# EAGLE design quantizer_v10 (EAGLE 9.6.2)

## Sheet 1 of 2
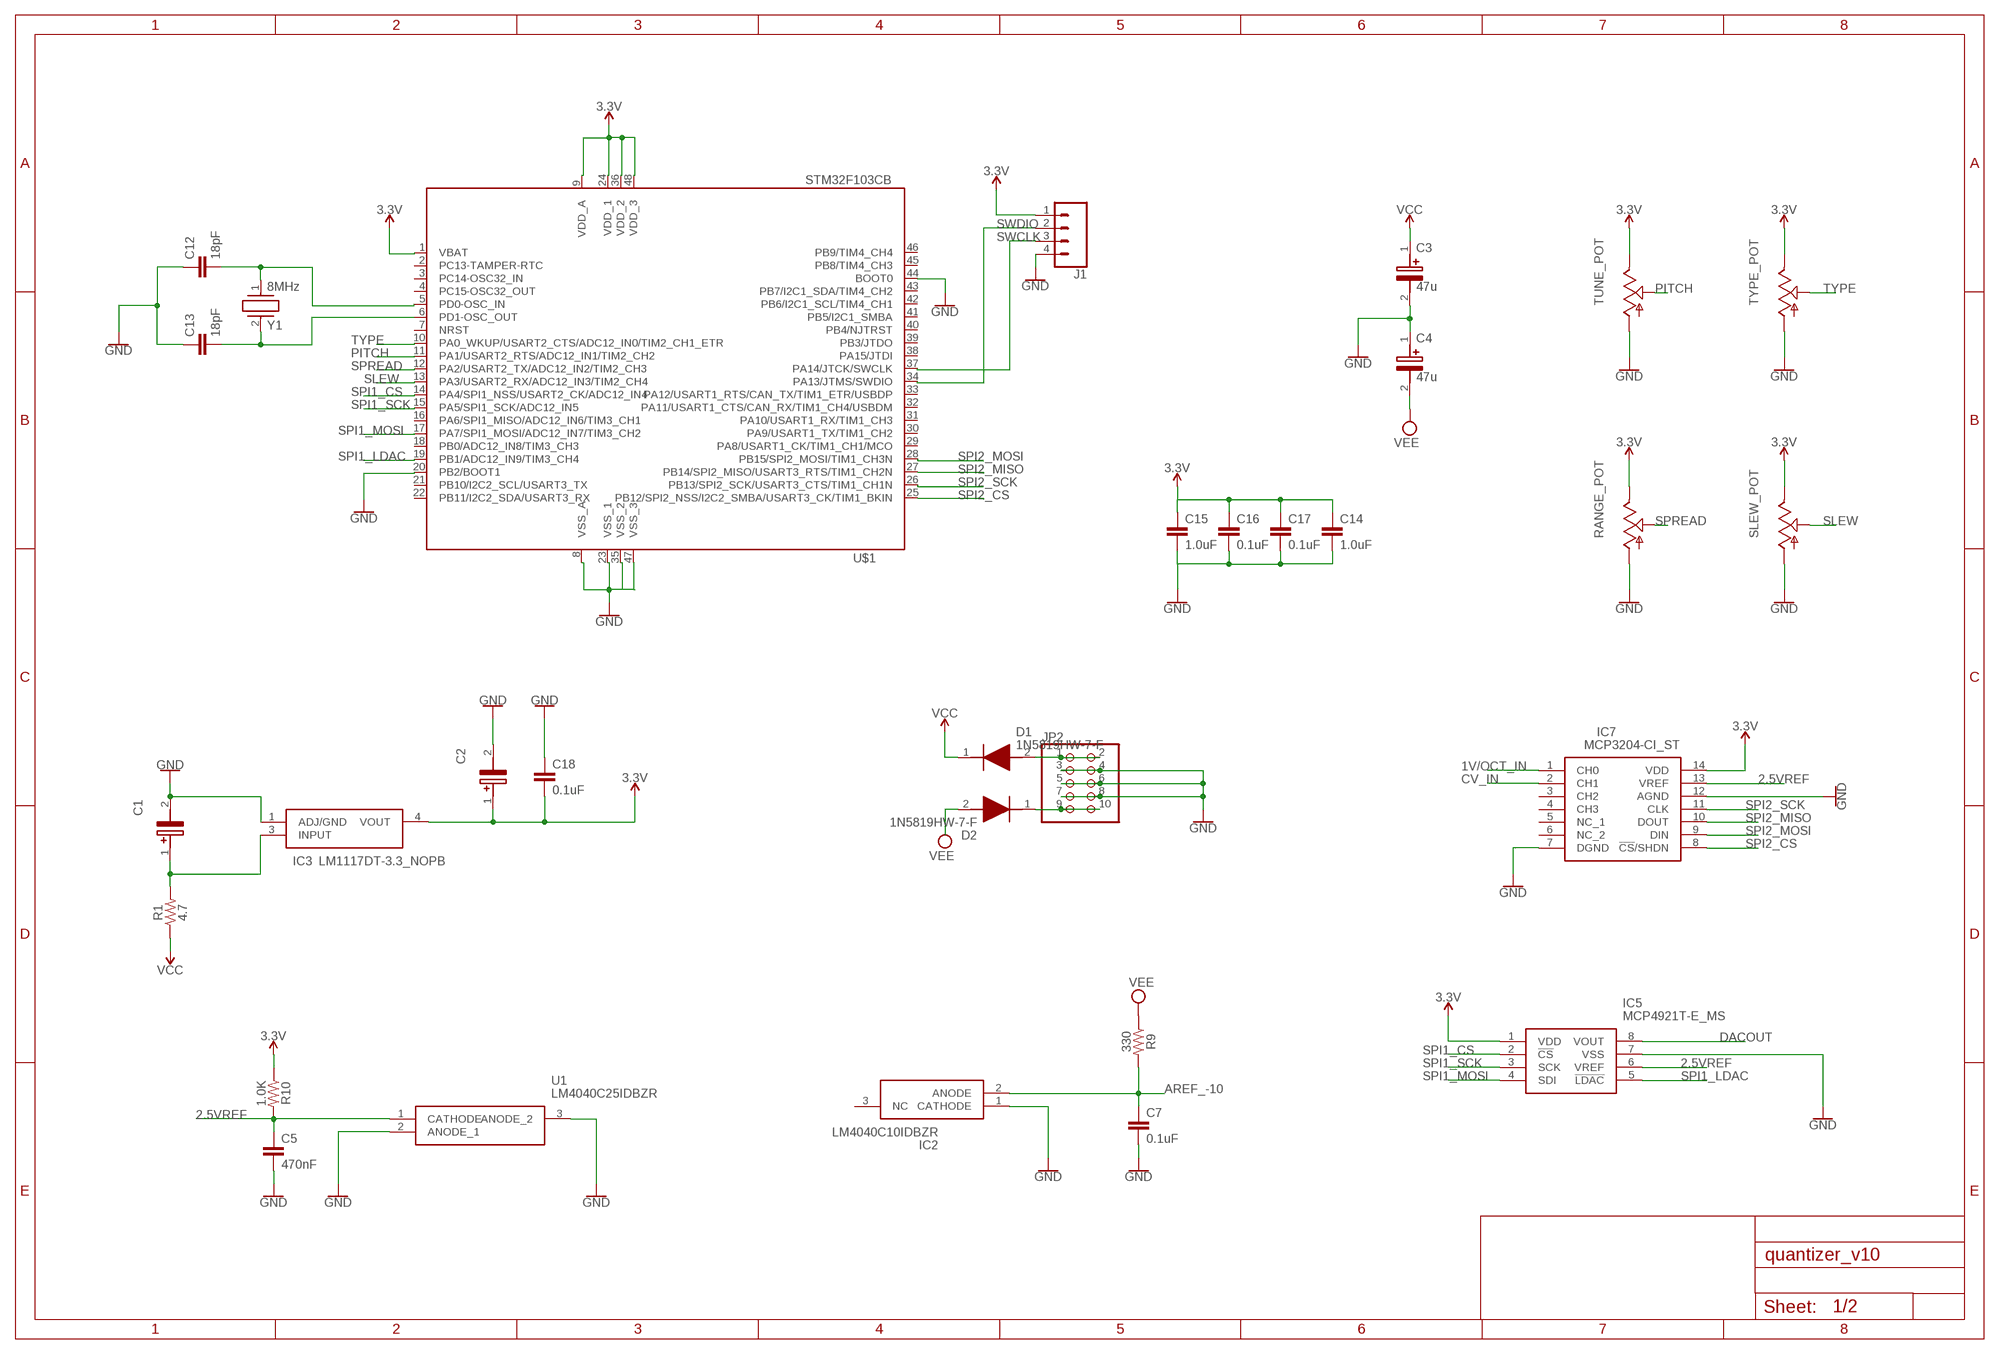
[diagram p0: schematic, sheet 1]

### Parts
C1  22uF  EEE-FP1E220AR  [EEE0GA101SR]
C2  22uF  EEE-FP1E220AR  [EEE0GA101SR]
C3  47u  EEE-FK1V470P  [EEE1AA101SP]
C4  47u  EEE-FK1V470P  [EEE1AA101SP]
C5  470nF  0.1UF-0603-25V-(+80/-20%)  [0603]
C7  0.1uF  0.1UF-0603-25V-(+80/-20%)  [0603]
C12  18pF  18PF-0603-50V-5%  [0603]
C13  18pF  18PF-0603-50V-5%  [0603]
C14  1.0uF  1.0UF-0603-16V-10%  [0603]
C15  1.0uF  1.0UF-0603-16V-10%  [0603]
C16  0.1uF  0.1UF-0603-25V-(+80/-20%)  [0603]
C17  0.1uF  0.1UF-0603-25V-(+80/-20%)  [0603]
C18  0.1uF  0.1UF-0603-25V-(+80/-20%)  [0603]
D1  1N5819HW-7-F  [SOD3716X145N]
D2  1N5819HW-7-F  [SOD3716X145N]
IC2  LM4040C10IDBZR  [SOT95P237X112-3N]
IC3  LM1117DT-3.3_NOPB  [TO228P991X238-3N]
IC5  MCP4921T-E_MS  [SOP65P490X110-8N]
IC7  MCP3204-CI_ST  [SOP65P640X120-14N]
J1  CONN_04  [1X04]
JP2  PINHD-2X5  [2X05]
R1  4.7  RESISTOR1206  [1206]
R9  330  RESISTOR0603  [0603]
R10  1.0K  RESISTOR0603  [0603]
RANGE_POT  POT_USVERTICAL_PS  [ALPS_POT_VERTICAL_PS]
SLEW_POT  POTENTIOMETER-ALPHA-9MM_VERTICAL_  [POTENTIOMETER-ALPHA-9MM_VERTICAL]
TUNE_POT  POT_USVERTICAL_PS  [ALPS_POT_VERTICAL_PS]
TYPE_POT  POT_USVERTICAL_PS  [ALPS_POT_VERTICAL_PS]
U1  LM4040C25IDBZR  [SOT95P237X112-3N]
U$1  STM32F103CB  [LQFP48]
Y1  8MHz  ABLS3-8.000MHZ-D4Y-T  [ABLS]

### Nets
1V/OCT_IN: IC7.1(CH0) ; also sheet 2
2.5VREF: C5.1 IC5.6(VREF) IC7.13(VREF) R10.2 U1.1(CATHODE)
3.3V: C2.1(+) C18.2 IC3.4(VOUT) IC5.1(VDD) IC7.14(VDD) J1.1 R10.1 RANGE_POT.P$1(E) SLEW_POT.3(E) TUNE_POT.P$1(E) TYPE_POT.P$1(E) U$1.1(VBAT) U$1.9(VDD_A) U$1.24(VDD_1) U$1.36(VDD_2) U$1.48(VDD_3)
AREF_-10: C7.1 IC2.2(ANODE) R9.2 ; also sheet 2
CV_IN: IC7.2(CH1) ; also sheet 2
DACOUT: IC5.8(VOUT) ; also sheet 2
GND: C1.2(-) C2.2(-) C3.2(-) C4.1(+) C5.2 C7.2 C12.1 C13.1 C18.1 IC2.1(CATHODE) IC3.1(ADJ/GND) IC5.7(VSS) IC7.7(DGND) IC7.12(AGND) J1.4 JP2.3 JP2.4 JP2.5 JP2.6 JP2.7 JP2.8 RANGE_POT.P$3(A) SLEW_POT.1(A) TUNE_POT.P$3(A) TYPE_POT.P$3(A) U1.2(ANODE_1) U1.3(ANODE_2) U$1.8(VSS_A) U$1.20(PB2/BOOT1) U$1.23(VSS_1) U$1.35(VSS_2) U$1.44(BOOT0) U$1.47(VSS_3) ; also sheet 2
N$2: C1.1(+) IC3.3(INPUT) R1.2
N$4: D1.2(A) JP2.1 JP2.2
N$6: D2.1(K) JP2.9 JP2.10
N$10: C12.2 U$1.5(PD0-OSC_IN) Y1.1
N$11: C13.2 U$1.6(PD1-OSC_OUT) Y1.2
N$12: C14.1 C15.1 C16.1 C17.1 ; supply symbol labelled 3.3V
N$14: C14.2 C15.2 C16.2 C17.2 ; supply symbol labelled GND
PITCH: TUNE_POT.P$2(S) U$1.11(PA1/USART2_RTS/ADC12_IN1/TIM2_CH2)
SLEW: SLEW_POT.2(S) U$1.13(PA3/USART2_RX/ADC12_IN3/TIM2_CH4)
SPI1_CS: IC5.2(!CS) U$1.14(PA4/SPI1_NSS/USART2_CK/ADC12_IN4)
SPI1_LDAC: IC5.5(!LDAC) U$1.19(PB1/ADC12_IN9/TIM3_CH4)
SPI1_MOSI: IC5.4(SDI) U$1.17(PA7/SPI1_MOSI/ADC12_IN7/TIM3_CH2)
SPI1_SCK: IC5.3(SCK) U$1.15(PA5/SPI1_SCK/ADC12_IN5)
SPI2_CS: IC7.8(!CS!/SHDN) U$1.25(PB12/SPI2_NSS/I2C2_SMBA/USART3_CK/TIM1_BKIN)
SPI2_MISO: IC7.10(DOUT) U$1.27(PB14/SPI2_MISO/USART3_RTS/TIM1_CH2N)
SPI2_MOSI: IC7.9(DIN) U$1.28(PB15/SPI2_MOSI/TIM1_CH3N)
SPI2_SCK: IC7.11(CLK) U$1.26(PB13/SPI2_SCK/USART3_CTS/TIM1_CH1N)
SPREAD: RANGE_POT.P$2(S) U$1.12(PA2/USART2_TX/ADC12_IN2/TIM2_CH3)
SWCLK: J1.3 U$1.37(PA14/JTCK/SWCLK)
SWDIO: J1.2 U$1.34(PA13/JTMS/SWDIO)
TYPE: TYPE_POT.P$2(S) U$1.10(PA0_WKUP/USART2_CTS/ADC12_IN0/TIM2_CH1_ETR)
VCC: C3.1(+) D1.1(K) R1.1 ; also sheet 2
VEE: C4.2(-) D2.2(A) R9.1 ; also sheet 2
Unconnected: IC2.3(NC) IC7.3(CH2) IC7.4(CH3) IC7.5(NC_1) IC7.6(NC_2) U$1.2(PC13-TAMPER-RTC) U$1.3(PC14-OSC32_IN) U$1.4(PC15-OSC32_OUT) U$1.7(NRST) U$1.16(PA6/SPI1_MISO/ADC12_IN6/TIM3_CH1) U$1.18(PB0/ADC12_IN8/TIM3_CH3) U$1.21(PB10/I2C2_SCL/USART3_TX) U$1.22(PB11/I2C2_SDA/USART3_RX) U$1.29(PA8/USART1_CK/TIM1_CH1/MCO) U$1.30(PA9/USART1_TX/TIM1_CH2) U$1.31(PA10/USART1_RX/TIM1_CH3) U$1.32(PA11/USART1_CTS/CAN_RX/TIM1_CH4/USBDM) U$1.33(PA12/USART1_RTS/CAN_TX/TIM1_ETR/USBDP) U$1.38(PA15/JTDI) U$1.39(PB3/JTDO) U$1.40(PB4/NJTRST) U$1.41(PB5/I2C1_SMBA) U$1.42(PB6/I2C1_SCL/TIM4_CH1) U$1.43(PB7/I2C1_SDA/TIM4_CH2) U$1.45(PB8/TIM4_CH3) U$1.46(PB9/TIM4_CH4)

## Sheet 2 of 2
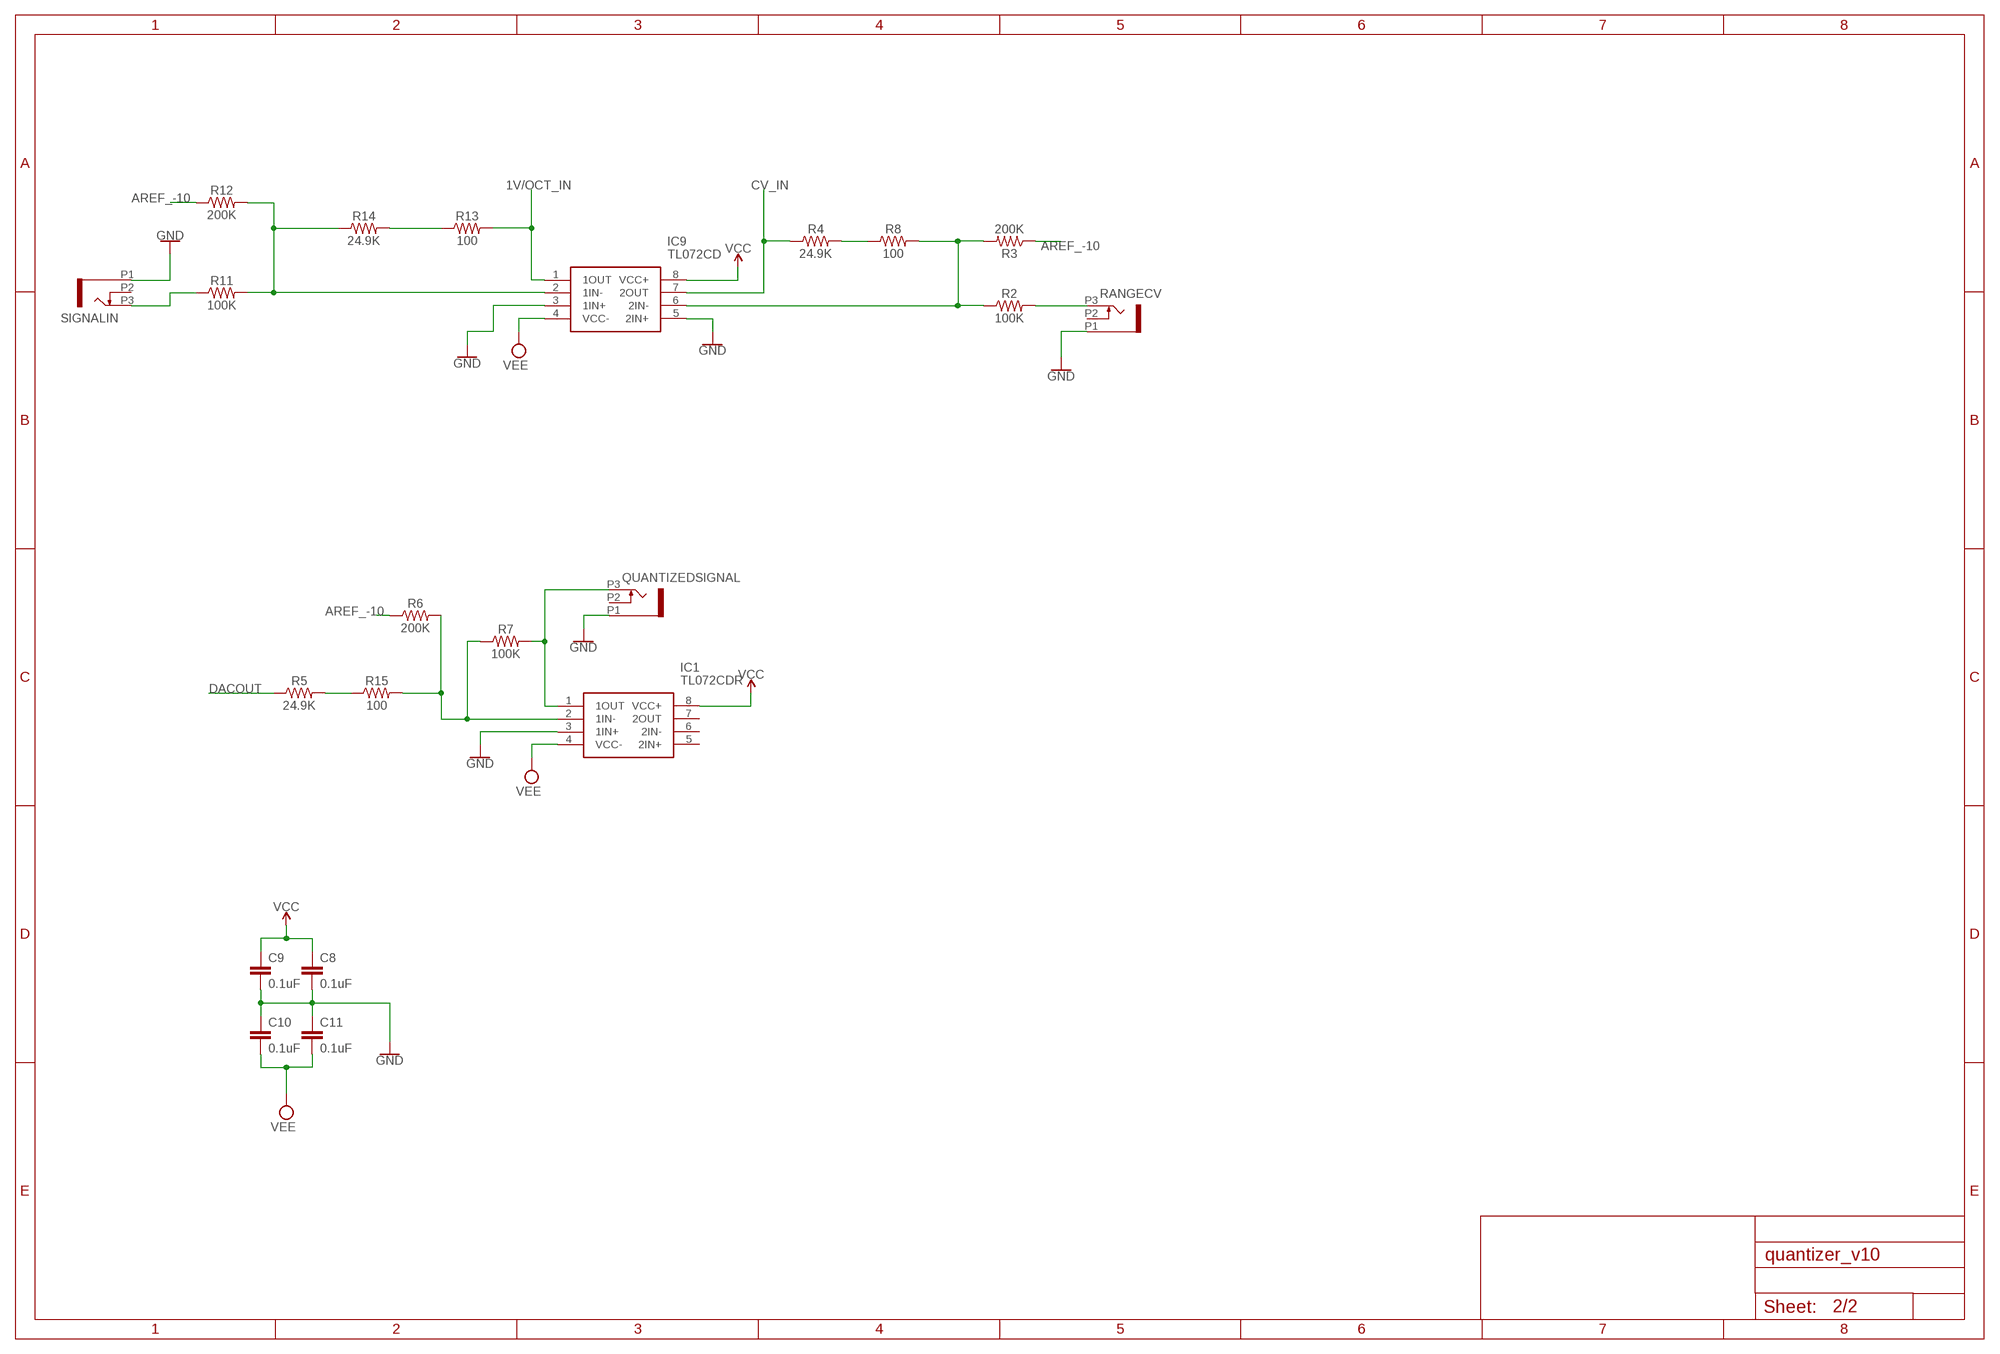
[diagram p1: schematic, sheet 2]

### Parts
C8  0.1uF  0.1UF-0603-25V-(+80/-20%)  [0603]
C9  0.1uF  0.1UF-0603-25V-(+80/-20%)  [0603]
C10  0.1uF  0.1UF-0603-25V-(+80/-20%)  [0603]
C11  0.1uF  0.1UF-0603-25V-(+80/-20%)  [0603]
IC1  TL072CDR  [SOIC127P600X175-8N]
IC9  TL072CD  [SOIC127P600X175-8N]
QUANTIZEDSIGNAL  PJ301_THONKICONN6  [WQP_PJ_301M6]
R2  100K  RESISTOR0603  [0603]
R3  200K  RESISTOR0603  [0603]
R4  24.9K  RESISTOR0603  [0603]
R5  24.9K  RESISTOR0603  [0603]
R6  200K  RESISTOR0603  [0603]
R7  100K  RESISTOR0603  [0603]
R8  100  RESISTOR0603  [0603]
R11  100K  RESISTOR0603  [0603]
R12  200K  RESISTOR0603  [0603]
R13  100  RESISTOR0603  [0603]
R14  24.9K  RESISTOR0603  [0603]
R15  100  RESISTOR0603  [0603]
RANGECV  PJ301_THONKICONN6  [WQP_PJ_301M6]
SIGNALIN  PJ301_THONKICONN6  [WQP_PJ_301M6]

### Nets
1V/OCT_IN: IC9.1(1OUT) R13.2 ; also sheet 1
AREF_-10: R3.1 R6.1 R12.1 ; also sheet 1
CV_IN: IC9.7(2OUT) R4.1 ; also sheet 1
DACOUT: R5.1 ; also sheet 1
GND: C8.2 C9.2 C10.1 C11.1 IC1.3(1IN+) IC9.3(1IN+) IC9.5(2IN+) QUANTIZEDSIGNAL.P1 RANGECV.P1 SIGNALIN.P1 ; also sheet 1
N$3: R4.2 R8.1
N$5: R11.1 SIGNALIN.P3
N$7: IC9.6(2IN-) R2.1 R3.2 R8.2
N$8: IC9.2(1IN-) R11.2 R12.2 R14.1
N$9: R2.2 RANGECV.P3
N$13: IC1.1(1OUT) QUANTIZEDSIGNAL.P3 R7.2
N$15: R13.1 R14.2
N$16: R5.2 R15.1
N$17: IC1.2(1IN-) R6.2 R7.1 R15.2
VCC: C8.1 C9.1 IC1.8(VCC+) IC9.8(VCC+) ; also sheet 1
VEE: C10.2 C11.2 IC1.4(VCC-) IC9.4(VCC-) ; also sheet 1
Unconnected: IC1.5(2IN+) IC1.6(2IN-) IC1.7(2OUT) QUANTIZEDSIGNAL.P2 RANGECV.P2 SIGNALIN.P2

## Library data of the parts
C1 C2 = EEE-FP1E220AR:EEE-FP1E220AR: PANASONIC - EEEFP1E220AR - SMD Aluminium Electrolytic Capacitor, Radial Can - SMD, 22 F, 25 V, 0.36 ohm, FP Series Source: Datasheet <http://industrial.panasonic.com/cdbs/www-data/pdf/RDE0000/ABA0000C1184.pdf>; DESCRIPTION: PANASONIC - EEEFP1E220AR - SMD Aluminium Electrolytic Capacitor, Radial Can - SMD, 22 F, 25 V, 0.36 ohm, FP Series; HEIGHT: 6.5mm; MANUFACTURER_NAME: Panasonic; MANUFACTURER_PART_NUMBER: EEE-FP1E220AR; MOUSER_PART_NUMBER: 667-EEE-FP1E220AR; MOUSER_PRICE-STOCK: https://www.mouser.co.uk/ProductDetail/Panasonic/EEE-FP1E220AR?qs=d1CqaRUMZD%252ByxlCLn0gmaw%3D%3D
C3 C4 = EEE-FK1V470P:EEE-FK1V470P: Aluminum Electrolytic Capacitors - SMD 47uF 35V Source: Datasheet <http://industrial.panasonic.com/cdbs/www-data/pdf/RDE0000/ABA0000C1181.pdf>; DESCRIPTION: Aluminum Electrolytic Capacitors - SMD 47uF 35V; HEIGHT: 7.8mm; MANUFACTURER_NAME: Panasonic; MANUFACTURER_PART_NUMBER: EEE-FK1V470P; MOUSER_PART_NUMBER: 667-EEE-FK1V470P; MOUSER_PRICE-STOCK: https://www.mouser.co.uk/ProductDetail/Panasonic/EEE-FK1V470P?qs=qE6bgDGEOCuVUX5CkiabHQ%3D%3D
C5 = SparkFun-Capacitors:0.1UF: 0.1µF ceramic capacitors A capacitor is a passive two-terminal electrical component used to store electrical energy temporarily in an electric field.; PROD_ID: CAP-00810; VALUE: 0.1uF
C7-C11 C16-C18 = SparkFun-Capacitors:0.1UF: 0.1µF ceramic capacitors A capacitor is a passive two-terminal electrical component used to store electrical energy temporarily in an electric field.; PROD_ID: CAP-00810
C12 C13 = SparkFun-Capacitors:18PF: 18pF ceramic capacitors A capacitor is a passive two-terminal electrical component used to store electrical energy temporarily in an electric field.; PROD_ID: CAP-08267
C14 C15 = SparkFun-Capacitors:1.0UF: 1µF ceramic capacitors A capacitor is a passive two-terminal electrical component used to store electrical energy temporarily in an electric field.; PROD_ID: CAP-00868
D1 D2 = 1N5819HW-7-F:1N5819HW-7-F: Diode Schottky 1A 40V SOD123 Diodes Inc 1N5819HW-7-F, SMT Schottky Diode, 40V 1A, 2-Pin SOD-123 Source: Datasheet <https://datasheet.datasheetarchive.com/originals/distributors/Datasheets-DGA23/1390892.pdf>; DESCRIPTION: Diode Schottky 1A 40V SOD123 Diodes Inc 1N5819HW-7-F, SMT Schottky Diode, 40V 1A, 2-Pin SOD-123; HEIGHT: 1.45mm; MANUFACTURER_NAME: Diodes Inc.; MANUFACTURER_PART_NUMBER: 1N5819HW-7-F; MOUSER_PART_NUMBER: 621-1N5819HW-F; MOUSER_PRICE-STOCK: https://www.mouser.co.uk/ProductDetail/Diodes-Incorporated/1N5819HW-7-F?qs=NQ47qNm99eDyWTEd07miYA%3D%3D
IC1 = TL072CDR:TL072CDR: Dual Low-Noise JFET-Input General-Purpose Operational Amplifier Source: Datasheet <http://www.ti.com/lit/ds/symlink/tl072.pdf>; DESCRIPTION: Dual Low-Noise JFET-Input General-Purpose Operational Amplifier; HEIGHT: 1.75mm; MANUFACTURER_NAME: Texas Instruments; MANUFACTURER_PART_NUMBER: TL072CDR; MOUSER_PART_NUMBER: 595-TL072CDR; MOUSER_PRICE-STOCK: https://www.mouser.co.uk/ProductDetail/Texas-Instruments/TL072CDR?qs=rshUhwi3fbas9IM4CCaZdw%3D%3D
IC2 = LM4040C10IDBZR:LM4040C10IDBZR: PRECISION MICROPOWER SHUNT VOLTAGE REFERENCE Source: Datasheet <http://www.ti.com/lit/gpn/lm4040>; DESCRIPTION: PRECISION MICROPOWER SHUNT VOLTAGE REFERENCE; HEIGHT: mm; MANUFACTURER_NAME: Texas Instruments; MANUFACTURER_PART_NUMBER: LM4040C10IDBZR; MOUSER_PART_NUMBER: 595-LM4040C10IDBZR; MOUSER_PRICE-STOCK: https://www.mouser.com/Search/Refine.aspx?Keyword=595-LM4040C10IDBZR
IC3 = LM1117DT-3.3_NOPB:LM1117DT-3.3_NOPB: Space saving 800-mA low-dropout linear regulator with internal current limit Source: Datasheet <https://datasheet.datasheetarchive.com/originals/distributors/Datasheets-SFU2/DSASFU100036103.pdf>; DESCRIPTION: Space saving 800-mA low-dropout linear regulator with internal current limit; HEIGHT: 2.38mm; MANUFACTURER_NAME: Texas Instruments; MANUFACTURER_PART_NUMBER: LM1117DT-3.3/NOPB; MOUSER_PART_NUMBER: 926-LM1117DT-3.3NOPB; MOUSER_PRICE-STOCK: https://www.mouser.co.uk/ProductDetail/Texas-Instruments/LM1117DT-3.3-NOPB?qs=X1J7HmVL2ZHOT670myqy2w%3D%3D
IC5 = MCP4921T-E_MS:MCP4921T-E_MS: Digital to Analog Converters - DAC Sgl 12-bit SPI int Source: Datasheet <http://www.microchip.com/mymicrochip/filehandler.aspx?ddocname=en547911>; DESCRIPTION: Digital to Analog Converters - DAC Sgl 12-bit SPI int; HEIGHT: 1.1mm; MANUFACTURER_NAME: Microchip; MANUFACTURER_PART_NUMBER: MCP4921T-E/MS; MOUSER_PART_NUMBER: 579-MCP4921T-E/MS; MOUSER_PRICE-STOCK: https://www.mouser.co.uk/ProductDetail/Microchip-Technology/MCP4921T-E-MS?qs=fM4xO01eazMZI7WjXZqD2A%3D%3D
IC7 = MCP3204-CI_ST:MCP3204-CI_ST: 4-Ch 12-Bit ADC 2.7V SPI TSSOP14 Microchip MCP3204-CI/ST, 12 bit Serial ADC,, 14-Pin TSSOP Source: Datasheet <http://www.microchip.com/wwwproducts/en/MCP3204>; DESCRIPTION: 4-Ch 12-Bit ADC 2.7V SPI TSSOP14 Microchip MCP3204-CI/ST, 12 bit Serial ADC,, 14-Pin TSSOP; HEIGHT: 1.2mm; MANUFACTURER_NAME: Microchip; MANUFACTURER_PART_NUMBER: MCP3204-CI/ST; MOUSER_PART_NUMBER: 579-MCP3204-CI/ST; MOUSER_PRICE-STOCK: https://www.mouser.co.uk/ProductDetail/Microchip-Technology/MCP3204-CI-ST?qs=9y3LFqDLL8Iux4kAt7A5qw%3D%3D
IC9 = TL072CD:TL072CD: Dual Low-Noise JFET-Input General-Purpose Operational Amplifier Source: Datasheet <http://www.ti.com/lit/ds/symlink/tl072.pdf>; DESCRIPTION: Dual Low-Noise JFET-Input General-Purpose Operational Amplifier; HEIGHT: 1.75mm; MANUFACTURER_NAME: Texas Instruments; MANUFACTURER_PART_NUMBER: TL072CD; MOUSER_PART_NUMBER: 595-TL072CD; MOUSER_PRICE-STOCK: https://www.mouser.co.uk/ProductDetail/Texas-Instruments/TL072CD?qs=5nGYs9Do7G0niDPig1J2Tw%3D%3D
J1 = SparkFun-Connectors:CONN_04: Multi connection point. Often used as Generic Header-pin footprint for 0.1 inch spaced/style header connections On any of the 0.1 inch spaced packages, you can populate with these: Break Away Headers - Straight <https://www.sparkfun.com/products/116> (PRT-00116) Break Away Male Headers - Right Angle <https://www.sparkfun.com/products/553> (PRT-00553) Female Headers <https://www.sparkfun.com/products/115> (PRT-00115) Break Away Headers - Machine Pin <https://www.sparkfun.com/products/117> (PRT-00117) Break Away Female Headers - Swiss Machine Pin <https://www.sparkfun.com/products/743> (PRT-00743) For SCREWTERMINALS and SPRING TERMINALS visit here: Screw Terimnals on SparkFun.com <https://www.sparkfun.com/search/results?term=Screw+Terminals> (5mm/3.5mm/2.54mm spacing) This device is also useful as a general connection point to wire up your design to another part of your project. Our various solder wires solder well into these plated through hole pads. Hook-Up Wire - Assortment (Stranded, 22 AWG) <https://www.sparkfun.com/products/11375> (PRT-11375) Hook-Up Wire - Assortment (Solid Core, 22 AWG) <https://www.sparkfun.com/products/11367> (PRT-11367) View the entire wire category on our website here <https://www.sparkfun.com/categories/141> Special notes: Molex polarized connector foot print use with SKU : PRT-08231 with associated crimp pins and housings. 1MM SMD Version SKU: PRT-10208; PROD_ID: CONN-09696
JP2 = pinhead:PINHD-2X5: PIN HEADER
QUANTIZEDSIGNAL RANGECV SIGNALIN = og-pj301_variations:PJ301_THONKICONN
R1-R15 = SparkFun-Resistors:RESISTOR: Generic Resistor Package
RANGE_POT TUNE_POT TYPE_POT = og-pots:POT_US
SLEW_POT = EURACK-MASTER-LIB:POTENTIOMETER-ALPHA-9MM_VERTICAL: 9mm vertical snap-in pot, Alpha / Panasonic style
U1 = LM4040C25IDBZR:LM4040C25IDBZR: TEXAS INSTRUMENTS - LM4040C25IDBZR - VOLTAGE REF, SHUNT, 2.5V, SOT-23-3 Source: Datasheet <https://datasheet.datasheetarchive.com/originals/distributors/Datasheets-DGA16/867624.pdf>; DESCRIPTION: TEXAS INSTRUMENTS - LM4040C25IDBZR - VOLTAGE REF, SHUNT, 2.5V, SOT-23-3; HEIGHT: 1.12mm; MANUFACTURER_NAME: Texas Instruments; MANUFACTURER_PART_NUMBER: LM4040C25IDBZR; MOUSER_PART_NUMBER: 595-LM4040C25IDBZR; MOUSER_PRICE-STOCK: https://www.mouser.co.uk/ProductDetail/Texas-Instruments/LM4040C25IDBZR?qs=VBduBm9rCJStNYDGENjZXg%3D%3D
U$1 = stm32:STM32F103CB
Y1 = ABLS3-8.000MHZ-D4Y-T:ABLS3-8.000MHZ-D4Y-T: HC49/US (AT49) LOW PROFILE SMD MICROPROCESSOR CRYSTAL Source: Datasheet <https://abracon.com/Resonators/abls.pdf>; DESCRIPTION: HC49/US (AT49) LOW PROFILE SMD MICROPROCESSOR CRYSTAL; HEIGHT: mm; MANUFACTURER_NAME: ABRACON; MANUFACTURER_PART_NUMBER: ABLS3-8.000MHZ-D4Y-T; MOUSER_PART_NUMBER: 815-ABLS3-8MD4YT; MOUSER_PRICE-STOCK: https://www.mouser.co.uk/ProductDetail/ABRACON/ABLS3-8000MHZ-D4Y-T?qs=WRzgYYgs9gC3im7pazpFGA%3D%3D

## Board
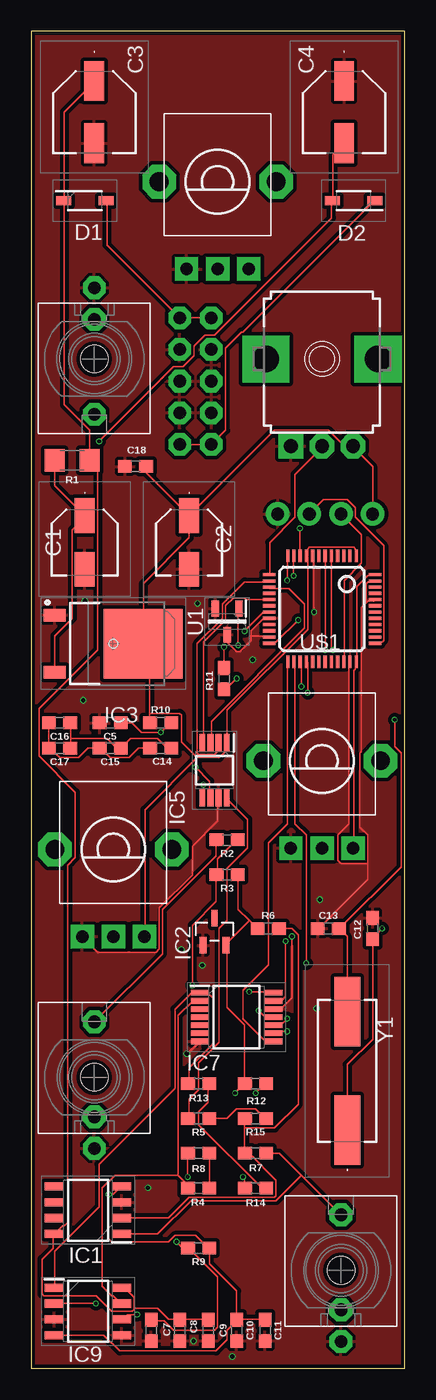
[diagram p2: board, top side]
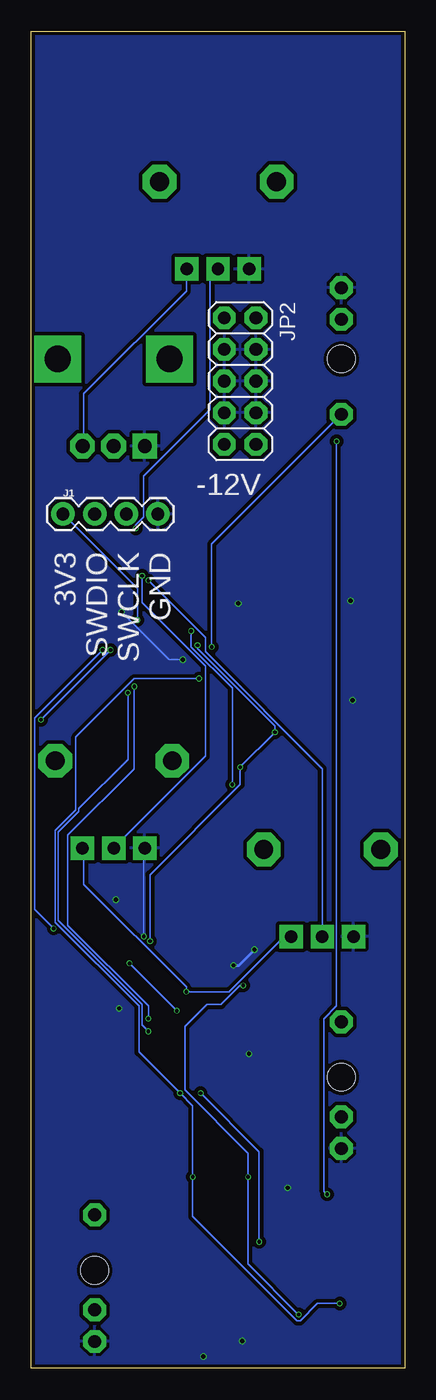
[diagram p3: board, bottom side, seen from below]

Size 30 x 107.34 mm. Coordinates in mm from the lower left corner, seen from the top.
Outline: 0,0 30,0 30,107.34 0,107.34 0,0
Copper layers (1*16): Top 0.035mm / dielectric 1.6mm / Bottom 0.035mm
Design rules "jlcpcb-2layers": minimum track width 5mil, minimum drill 0.3mm, track to track 5mil, track to pad 5mil, pad to pad 5mil, via to via 5mil, smd to smd 5mil, copper to edge 0.2mm, drill to drill 6mil, minimum pad ring 10mil, minimum via ring 3mil, stop-mask expansion 4mil, vias tented up to drill 0mil, thermal gap 10mil

### Footprints (pad centres in the part's own frame; a part is rotated, then mirrored left to right if it is on the bottom)
EEE0GA101SR = smd 2.8 x 1.6: 1 -2.15,0; 2 2.15,0
EEE1AA101SP = smd 3.2 x 1.6: 1 -2.5,0; 2 2.5,0
0603 = smd 1.1 x 1: 1 -0.85,0; 2 0.85,0
SOD3716X145N = smd 1.2 x 0.75: 1 -1.7,0; 2 1.7,0
SOIC127P600X175-8N = smd 1.525 x 0.65: 1 -2.712,1.905; 2 -2.712,0.635; 3 -2.712,-0.635; 4 -2.712,-1.905; 5 2.712,-1.905; 6 2.712,-0.635; 7 2.712,0.635; 8 2.712,1.905
SOT95P237X112-3N = smd 1.321 x 0.559: 1 -1.092,0.94; 2 -1.092,-0.94 | smd 1.321 x 0.508: 3 1.092,0
TO228P991X238-3N = smd 1.75 x 1: 1 -4.7,2.285; 3 -4.7,-2.285 | smd 6.35 x 5.55: 4 2.4,0
SOP65P490X110-8N = smd 1.4 x 0.45: 1 -2.2,0.975; 2 -2.2,0.325; 3 -2.2,-0.325; 4 -2.2,-0.975; 5 2.2,-0.975; 6 2.2,-0.325; 7 2.2,0.325; 8 2.2,0.975
SOP65P640X120-14N = smd 1.475 x 0.45: 1 -2.938,1.95; 2 -2.938,1.3; 3 -2.938,0.65; 4 -2.938,0; 5 -2.938,-0.65; 6 -2.938,-1.3; 7 -2.938,-1.95; 8 2.938,-1.95; 9 2.938,-1.3; 10 2.938,-0.65; 11 2.938,0; 12 2.938,0.65; 13 2.938,1.3; 14 2.938,1.95
SOIC127P600X175-8N' = smd 1.528 x 0.65: 1 -2.711,1.905; 2 -2.711,0.635; 3 -2.711,-0.635; 4 -2.711,-1.905; 5 2.711,-1.905; 6 2.711,-0.635; 7 2.711,0.635; 8 2.711,1.905
1X04 = drill 1.016 pad 1.88: 1 0,0; 2 2.54,0; 3 5.08,0; 4 7.62,0
2X05 = drill 1.016 octagon: 1 -5.08,-1.27; 2 -5.08,1.27; 3 -2.54,-1.27; 4 -2.54,1.27; 5 0,-1.27; 6 0,1.27; 7 2.54,-1.27; 8 2.54,1.27; 9 5.08,-1.27; 10 5.08,1.27
WQP_PJ_301M6 = drill 1.016 pad 1.778 octagon: P1 0,-5.715; P2 0,-3.175; P3 0,4.445 | hole 2.2: 0,0
1206 = smd 1.6 x 1.8: 1 -1.4,0; 2 1.4,0
ALPS_POT_VERTICAL_PS = drill 1 pad 1.88 square: P$1 -2.5,7; P$2 0,7; P$3 2.5,7 | drill 1.5 pad 2.54 octagon: P$4 -4.7,0; P$5 4.7,0
POTENTIOMETER-ALPHA-9MM_VERTICAL = drill 1.1 pad 1.676 square: 1 -2.5,-7 | drill 1.1 pad 1.676 octagon: 2 0,-7; 3 2.5,-7 | drill 2.1 pad 2.8 square: M1 4.5,0; M2 -4.5,0
SOT95P237X112-3N' = smd 1.25 x 0.6: 1 -1.05,0.95; 2 -1.05,-0.95; 3 1.05,0
LQFP48 = smd 0.254 x 1: 1 -2.75,-4.25; 2 -2.25,-4.25; 3 -1.75,-4.25; 4 -1.25,-4.25; 5 -0.75,-4.25; 6 -0.25,-4.25; 7 0.25,-4.25; 8 0.75,-4.25; 9 1.25,-4.25; 10 1.75,-4.25; 11 2.25,-4.25; 12 2.75,-4.25; 25 2.75,4.25; 26 2.25,4.25; 27 1.75,4.25; 28 1.25,4.25; 29 0.75,4.25; 30 0.25,4.25; 31 -0.25,4.25; 32 -0.75,4.25; 33 -1.25,4.25; 34 -1.75,4.25; 35 -2.25,4.25; 36 -2.75,4.25 | smd 1 x 0.254: 13 4.25,-2.75; 14 4.25,-2.25; 15 4.25,-1.75; 16 4.25,-1.25; 17 4.25,-0.75; 18 4.25,-0.25; 19 4.25,0.25; 20 4.25,0.75; 21 4.25,1.25; 22 4.25,1.75; 23 4.25,2.25; 24 4.25,2.75; 37 -4.25,2.75; 38 -4.25,2.25; 39 -4.25,1.75; 40 -4.25,1.25; 41 -4.25,0.75; 42 -4.25,0.25; 43 -4.25,-0.25; 44 -4.25,-0.75; 45 -4.25,-1.25; 46 -4.25,-1.75; 47 -4.25,-2.25; 48 -4.25,-2.75
ABLS = smd 5.6 x 2.1: 1 -4.75,0; 2 4.75,0

### Placement (x,y rotation side)
C1  4.32,66.29 270 top
C2  12.7,66.29 270 top
C3  5.08,100.84 270 top
C4  25.15,100.84 270 top
C5  6.35,51.82 180 top
C7  9.65,3.05 270 top
C8  11.94,3.05 270 top
C9  14.22,3.05 270 top
C10  16.51,3.05 90 top
C11  18.8,3.05 90 top
C12  27.43,35.31 270 top
C13  23.88,35.31 0 top
C14  10.41,49.78 180 top
C15  6.35,49.78 180 top
C16  2.29,51.82 180 top
C17  2.29,49.78 180 top
C18  8.38,72.39 0 top
D1  4.32,93.73 0 top
D2  25.91,93.73 180 top
IC1  4.57,12.7 180 top
IC2  14.73,35.05 90 top
IC3  6.6,58.17 0 top
IC5  14.73,48.01 270 top
IC7  16.51,28.19 0 top
IC9  TL072CD  [SOIC127P600X175-8N']  4.57,4.57 0 top
J1  27.43,68.58 0 bottom
JP2  13.21,79.25 270 bottom
QUANTIZEDSIGNAL  24.89,7.87 0 top
R1  3.3,72.9 180 top
R2  15.75,42.42 180 top
R3  15.75,39.62 180 top
R4  13.46,14.48 0 top
R5  13.46,20.07 0 top
R6  19.05,35.31 0 top
R7  18.03,17.27 0 top
R8  13.46,17.27 180 top
R9  13.46,9.65 180 top
R10  10.41,51.82 0 top
R11  15.49,55.37 270 top
R12  18.03,22.86 0 top
R13  13.46,22.86 180 top
R14  18.03,14.48 0 top
R15  18.03,20.07 180 top
RANGE_POT  6.6,41.66 180 top
RANGECV  5.08,23.37 0 top
SIGNALIN  5.08,81.03 180 top
SLEW_POT  23.37,81.03 0 top
TUNE_POT  23.37,48.77 180 top
TYPE_POT  14.99,95.25 180 top
U1  LM4040C25IDBZR  [SOT95P237X112-3N']  15.75,59.94 270 top
U$1  23.37,60.96 180 top
Y1  25.4,23.88 90 top

### Tracks (layer width: path | path; a pad name or v marks a point on that pad's centre or on a via)
1V/OCT_IN
  Top 0.127: R13.2 12.7,22.86 12.7,24.13 14.61,26.04 14.61,29.72 14.22,30.1 13.59,30.1 IC7.1 13.46,30.1 12.83,30.1 11.56,28.83 11.56,22.48 5.46,16.38 5.46,12.95 1.91,9.4 1.91,6.48 IC9.1
2.5VREF  (via drill 0.3)
  Top 0.127: C5.1 8.13,51.82 8.89,51.05 v10.41,51.05 11.18,51.82 R10.2 | v16.64,58.04 16.64,60.96 U1.1 | v13.21,48.26 14.35,47.12 14.35,45.85 IC5.6 | v20.45,34.29 20.45,29.84 20.19,29.59 19.56,29.59 IC7.13
  Bottom 0.127: v16.64,58.04 16.64,57.78 10.41,51.56 v10.41,51.05 v13.21,48.26 13.21,46.86 20.45,39.62 v20.45,34.29
3.3V  (via drill 0.3)
  Top 0.127: v21.46,60.07 19.68,58.29 19.18,58.29 U$1.24 | J1.1 27.43,72.39 25.91,73.91 SLEW_POT.3 25.78,74.04 25.15,74.04 23.88,75.31 19.56,75.31 12.7,68.45 | 12.7,68.45 9.27,71.88 9.27,72.39 C18.2 | U$1.1 26.04,65.28 26.04,65.79 25.91,65.91 22.35,65.91 22.23,65.79 22.23,65.28 U$1.9 22.23,65.15 22.23,59.31 15.75,52.83 15.75,50.29 IC5.1 15.62,50.16 15.62,49.53 15.11,49.02 13.34,49.02 | 9.53,52.58 9.53,57.66 9.02,58.17 | 9.53,52.58 9.53,51.82 R10.1 | 13.34,49.02 12.06,50.29 12.06,52.45 11.94,52.58 9.53,52.58 | 9.02,58.17 9.02,62.99 12.7,66.67 C2.1 12.7,68.45 | 9.02,58.17 IC3.4 | v17.53,30.23 19.43,30.23 IC7.14 | U$1.48 27.56,63.63 27.05,63.63 26.16,62.74 26.16,56.77 U$1.36 26.04,56.64 26.04,56.13 25.91,56.01 25.91,41.78 TUNE_POT.P$1 | 13.34,49.02 9.14,44.83 9.14,34.67 RANGE_POT.P$1
  Bottom 0.127: v21.46,60.07 21.46,62.61 J1.1 | TYPE_POT.P$1 17.53,88.14 17.53,86.49 25.78,78.23 25.78,74.04 SLEW_POT.3 | RANGE_POT.P$1 9.14,34.54 9.78,34.54 14.1,30.23 v17.53,30.23 17.53,30.61 25.78,38.86 25.78,41.66 TUNE_POT.P$1
AREF_-10  (via drill 0.3)
  Top 0.127: C7.1 9.65,3.81 10.67,3.81 11.43,3.05 14.73,3.05 14.99,3.3 14.99,7.37 12.7,9.65 R9.2 12.19,9.65 v11.68,10.16 | 17.53,35.94 18.16,35.31 R6.1 | 17.53,35.94 16.64,36.83 16.64,39.62 R3.1 | 17.14,22.86 17.14,27.56 15.75,28.96 15.75,33.91 IC2.2 15.62,34.04 17.53,35.94 | 17.14,22.86 v16.38,22.1 | 17.14,22.86 R12.1
  Bottom 0.127: v11.68,10.16 11.68,17.4 v16.38,22.1
CV_IN
  Top 0.127: 11.81,15.49 12.57,14.73 12.57,14.48 R4.1 | 11.81,15.49 11.81,28.32 12.95,29.46 13.46,29.46 IC7.2 | 11.81,15.49 6.73,15.49 5.71,14.48 5.71,6.6 6.48,5.84 6.6,5.84 7.24,5.21 IC9.7
DACOUT
  Top 0.127: R5.1 12.7,20.07 12.7,21.59 13.46,22.35 13.46,24.51 15.11,26.16 15.11,35.31 15.75,35.94 15.75,40.13 17.4,41.78 17.4,44.07 15.75,45.72 IC5.8
GND  (via drill 0.3, 0.35)
  Top 0.127: 17.65,58.8 17.65,58.42 16.76,57.53 16.51,57.53 15.75,58.29 U1.3 | 17.65,58.8 17.65,59.18 18.67,60.2 19.05,60.2 U$1.20 | 26.92,61.47 26.54,61.09 26.54,49.53 26.42,49.4 26.42,43.43 27.05,42.8 27.05,40.51 | 26.92,61.47 27.05,61.59 27.56,61.59 U$1.44 | 27.05,40.51 27.05,39.24 23.11,35.31 C13.1 | IC5.7 14.99,45.72 14.99,43.94 12.95,41.91 12.95,39.62 10.29,36.96 10.29,33.66 10.03,33.4 5.33,33.4 4.19,34.54 RANGE_POT.P$3 | v20.95,34.67 20.95,29.72 20.19,28.96 19.56,28.96 IC7.12 | 17.65,58.8 19.05,58.8 U$1.23 | v22.73,60.71 22.73,65.15 U$1.8 | 27.05,40.51 24.89,40.51 24.64,40.77 24.64,42.8 25.53,43.69 25.53,56.64 U$1.35 | 26.92,61.47 26.92,62.99 27.05,63.12 27.56,63.12 U$1.47
  Top 0.254: IC7.7 12.58,25.25 v12.5,25.25
  Bottom 0.127: v20.95,34.67 20.95,41.66 TUNE_POT.P$3 | v22.73,60.71 18.92,56.9 17.91,56.9 v17.81,56.87
  Bottom 0.254: v13.74,32.34 13.32,32.34 v12.06,33.6
  other vias: 23.2,37.63 22.93,28.9 13.37,61.4 13.05,2.2 16.16,0.96 4.33,61.62 4.18,53.64 9.39,14.49
  pour Top (isolate 0.305): 0,107.44 29.97,107.44 29.97,0 0,0
  pour Bottom (isolate 0.305): 0,0 0,107.44 29.97,107.44 29.97,0
N$2
  Top 0.127: IC3.3 1.91,56.01 1.91,58.8 3.3,60.2 3.3,67.31 4.32,68.33 C1.1 4.32,68.45 1.91,70.87 R1.2
N$3
  Top 0.127: R4.2 14.35,14.48 14.35,17.27 R8.1
N$4
  Top 0.127: D1.2 6.1,93.73 6.1,90.17 JP2.2 JP2.1
N$5  (via drill 0.3)
  Top 0.127: v15.49,57.91 R11.1
  Bottom 0.127: v15.49,57.91 15.49,66.17 SIGNALIN.P3
N$6
  Top 0.127: D2.1 27.56,93.73 17.02,83.19 16.89,83.19 15.62,81.92 15.62,75.31 JP2.9 JP2.10
N$7  (via drill 0.3)
  Top 0.127: R2.1 16.51,42.42 14.99,40.89 14.99,39.62 R3.2 14.86,39.62 14.86,37.47 12.95,35.56 v12.95,30.73 | v12.57,15.37 12.57,17.27 R8.2 | v8.51,4.32 7.75,4.32 7.37,3.94 IC9.6
  Bottom 0.127: v8.51,4.32 12.57,8.38 v12.57,15.37 12.57,17.27 17.65,22.35 17.65,27.43 15.88,29.21 14.73,29.21 13.21,30.73 v12.95,30.73
N$8  (via drill 0.3)
  Top 0.127: v17.02,15.37 17.14,15.24 17.14,14.48 R14.1 | v18.03,22.1 18.8,22.86 R12.2 | v16.51,55.37 15.75,54.61 15.49,54.61 R11.2 | v5.21,5.21 IC9.2
  Bottom 0.127: v16.51,55.37 21.72,55.37 26.42,50.67 26.42,44.83 28.07,43.18 28.07,35.81 21.34,29.08 21.34,25.4 v18.03,22.1 17.02,21.08 v17.02,15.37 17.02,12.19 8.64,3.81 8.38,3.81 6.99,5.21 v5.21,5.21
N$9
  Top 0.127: RANGECV.P3 10.54,33.27 10.54,36.83 14.86,41.15 14.86,42.42 R2.2
N$10  (via drill 0.3)
  Top 0.127: v24.26,57.66 24.13,57.78 24.13,65.15 U$1.5 | v28.19,35.31 27.43,34.54 C12.2 27.43,26.42 25.4,24.38 Y1.1
  Bottom 0.127: v24.26,57.66 29.72,52.2 29.72,36.83 v28.19,35.31
N$11  (via drill 0.3)
  Top 0.127: v23.62,57.66 23.62,65.15 U$1.6 | v29.21,52.07 29.21,49.91 29.72,49.4 29.72,40.26 24.77,35.31 | Y1.2 25.4,34.67 24.77,35.31 | 24.77,35.31 C13.2
  Bottom 0.127: v29.21,52.07 v23.62,57.66
N$12
  Top 0.127: 3.17,50.55 3.17,51.82 C16.1 | 3.17,50.55 3.17,49.78 C17.1 | 3.17,50.55 6.1,50.55 6.86,49.78 C15.1 7.24,49.78 8,50.55 10.16,50.55 10.92,49.78 C14.1
N$13
  Top 0.127: R7.2 19.94,17.27 21.72,15.49 | QUANTIZEDSIGNAL.P3 21.72,15.49 | IC1.1 10.16,10.79 12.83,13.46 19.68,13.46 21.72,15.49
N$14
  Top 0.127: C16.2 1.4,51.82 1.4,49.78 C17.2 1.52,49.78 2.29,49.02 3.81,49.02 4.57,49.78 C15.2 5.59,49.78 6.35,49.02 7.87,49.02 8.64,49.78 C14.2
N$15
  Top 0.127: R14.2 18.54,14.48 13.46,19.56 13.46,20.57 14.22,21.34 14.22,22.86 R13.1
N$16
  Top 0.127: R5.2 15.75,20.07 16.51,20.83 18.03,20.83 18.8,20.07 R15.1
N$17
  Top 0.127: 17.14,19.3 17.14,20.07 R15.2 | 17.14,19.3 17.14,17.27 R7.1 17.53,17.27 19.68,15.11 19.68,13.84 19.56,13.72 12.7,13.72 11.05,12.06 IC1.2 | R6.2 20.95,35.31 21.46,34.8 21.46,21.21 19.56,19.3 17.14,19.3
PITCH  (via drill 0.3)
  Top 0.127: v21.08,63.63 21.08,65.15 U$1.11
  Bottom 0.127: v21.08,63.63 21.08,61.47 16,56.39 16,49.15 23.37,41.78 TUNE_POT.P$2
SLEW
  Top 0.127: U$1.13 19.18,63.75 19.18,66.29 21.21,68.33 21.21,71.75 23.37,73.91 SLEW_POT.2
SPI1_CS
  Top 0.127: U$1.14 19.05,63.12 17.14,63.12 15.37,61.34 15.37,60.2 13.34,58.17 13.34,49.4 13.46,49.28 14.73,49.28 14.99,49.53 14.99,50.16 IC5.2
SPI1_LDAC  (via drill 0.3)
  Top 0.127: v17.14,59.18 18.67,60.71 19.05,60.71 U$1.19 | v13.84,46.86 13.84,45.85 IC5.5
  Bottom 0.127: v17.14,59.18 17.14,57.91 13.84,54.61 v13.84,46.86
SPI1_MOSI
  Top 0.127: U$1.17 19.05,61.72 17.27,61.72 17.14,61.85 16.26,61.85 15.62,61.21 15.62,60.07 13.84,58.29 13.84,50.29 IC5.4
SPI1_SCK
  Top 0.127: U$1.15 19.18,62.61 20.7,62.61 21.97,61.34 21.97,59.44 14.48,51.94 14.48,50.29 IC5.3
SPI2_CS
  Top 0.127: U$1.25 20.57,56.64 20.57,43.69 19.05,42.16 19.05,32.38 17.02,30.35 17.02,28.07 18.8,26.29 19.43,26.29 IC7.8
SPI2_MISO  (via drill 0.3)
  Top 0.127: v21.72,54.74 21.72,56.64 U$1.27 | v20.57,28.07 20.07,27.56 19.56,27.56 IC7.10
  Bottom 0.127: v21.72,54.74 21.72,48.13 27.05,42.8 27.05,35.56 20.57,29.08 v20.57,28.07
SPI2_MOSI  (via drill 0.3)
  Top 0.127: v22.23,54.23 22.23,56.64 U$1.28 | v20.57,27.05 19.68,27.05 19.56,26.92 IC7.9
  Bottom 0.127: v22.23,54.23 22.23,48.9 26.16,44.96 26.16,44.7 27.81,43.05 27.81,35.94 21.08,29.21 21.08,27.56 v20.57,27.05
SPI2_SCK  (via drill 0.3)
  Top 0.127: v22.1,32.51 22.1,42.8 21.21,43.69 21.21,56.64 U$1.26 | v18.29,28.7 18.8,28.19 IC7.11
  Bottom 0.127: v18.29,28.7 v22.1,32.51
SPREAD  (via drill 0.3)
  Top 0.127: v20.57,63.25 20.57,65.15 U$1.12
  Bottom 0.127: v20.57,63.25 16,58.67 16,57.53 6.6,48.13 RANGE_POT.P$2
SWCLK
  Top 0.127: J1.3 23.5,69.72 25.4,69.72 26.04,69.09 26.04,68.33 28.32,66.04 28.32,58.42 28.19,58.29 27.69,58.29 U$1.37
SWDIO
  Top 0.127: J1.2 26.54,66.93 26.54,64.64 25.15,63.25 25.15,56.77 U$1.34
TYPE  (via drill 0.3)
  Top 0.127: v21.59,67.44 21.59,65.28 U$1.10
  Bottom 0.127: v21.59,67.44 21.59,67.69 20.95,68.33 20.95,71.63 15.62,76.96 15.62,87.5 14.99,88.14 TYPE_POT.P$2
VCC
  Top 0.127: 11.94,3.94 14.22,3.94 C9.1 | 8.26,4.83 8.26,5.71 7.49,6.48 IC9.8 | 8.26,4.83 8.26,4.7 8.13,4.57 6.48,4.57 5.21,5.84 1.02,5.84 0.89,5.97 0.89,8.76 1.78,9.65 1.78,10.79 IC1.8 1.91,10.79 2.54,11.43 2.67,11.43 2.92,11.68 2.92,40.39 3.56,41.02 3.56,46.23 0.64,49.15 0.64,52.96 5.33,57.66 5.33,72.39 4.83,72.9 R1.1 4.7,75.31 2.67,77.34 2.67,93.73 | 11.94,3.94 11.05,3.94 10.16,4.83 8.26,4.83 | 11.94,3.94 C8.1 | 2.67,93.73 2.67,100.84 5.08,103.25 C3.1 | 2.67,93.73 D1.1
VEE  (via drill 0.3)
  Top 0.127: C4.2 25.15,98.3 24.26,97.41 24.26,93.73 D2.2 24.13,93.73 24.13,92.33 14.73,82.93 13.97,82.93 13.08,82.04 13.08,81.28 12.19,80.39 11.43,80.39 v5.46,74.42 | 16.51,3.94 18.8,3.94 C11.2 | 16.51,3.94 16.51,6.22 14.35,8.38 14.35,9.65 R9.1 14.22,9.65 13.21,10.67 11.56,10.67 11.05,10.16 6.48,10.16 6.22,10.41 6.22,13.72 6.35,13.84 | 16.51,3.94 C10.2 16.51,3.81 15.75,3.05 15.75,2.29 14.86,1.4 7.11,1.4 5.84,2.67 IC9.4 | 6.35,13.84 6.48,13.97 6.6,13.97 7.24,14.61 IC1.4 | 6.35,13.84 v6.22,13.97
  Bottom 0.127: v5.46,74.42 5.46,29.08 6.48,28.07 6.48,14.22 v6.22,13.97

### Text on the board
bPlace: -12V | GND | SWCLK | SWDIO | 3V3